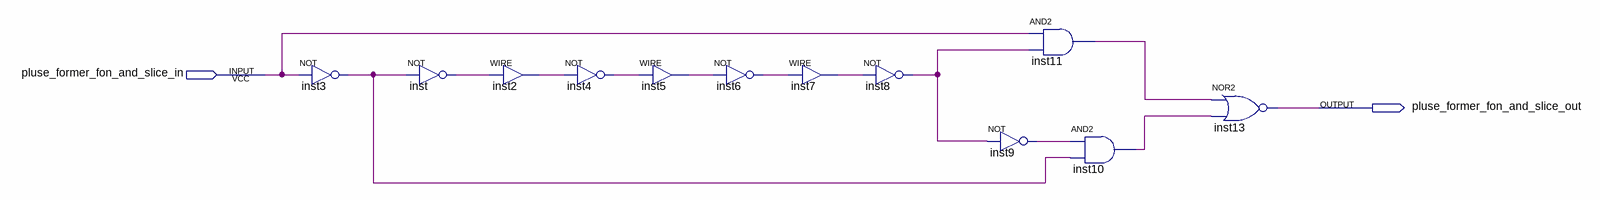
[diagram p0: schematic sheet]
// Quartus schematic pluse_former_fon_and_slice.bdf as structural Verilog: 12 symbols, 2 pins
module pluse_former_fon_and_slice (
  input  pluse_former_fon_and_slice_in,
  output pluse_former_fon_and_slice_out
);

  wire inst2_out, inst3_out, inst4_out, inst5_out, inst6_out, inst7_out, inst8_out, inst9_out, inst10_out,
       inst11_out, inst_out;

  not inst3 (inst3_out, pluse_former_fon_and_slice_in);
  not inst (inst_out, inst3_out);
  assign inst2_out = inst_out;  // WIRE inst2
  not inst4 (inst4_out, inst2_out);
  assign inst5_out = inst4_out;  // WIRE inst5
  not inst6 (inst6_out, inst5_out);
  assign inst7_out = inst6_out;  // WIRE inst7
  not inst8 (inst8_out, inst7_out);
  not inst9 (inst9_out, inst8_out);
  and inst11 (inst11_out, pluse_former_fon_and_slice_in, inst8_out);
  and inst10 (inst10_out, inst9_out, inst3_out);
  nor inst13 (pluse_former_fon_and_slice_out, inst11_out, inst10_out);
endmodule
